# EAGLE design MainBoard (EAGLE 7.3.0)
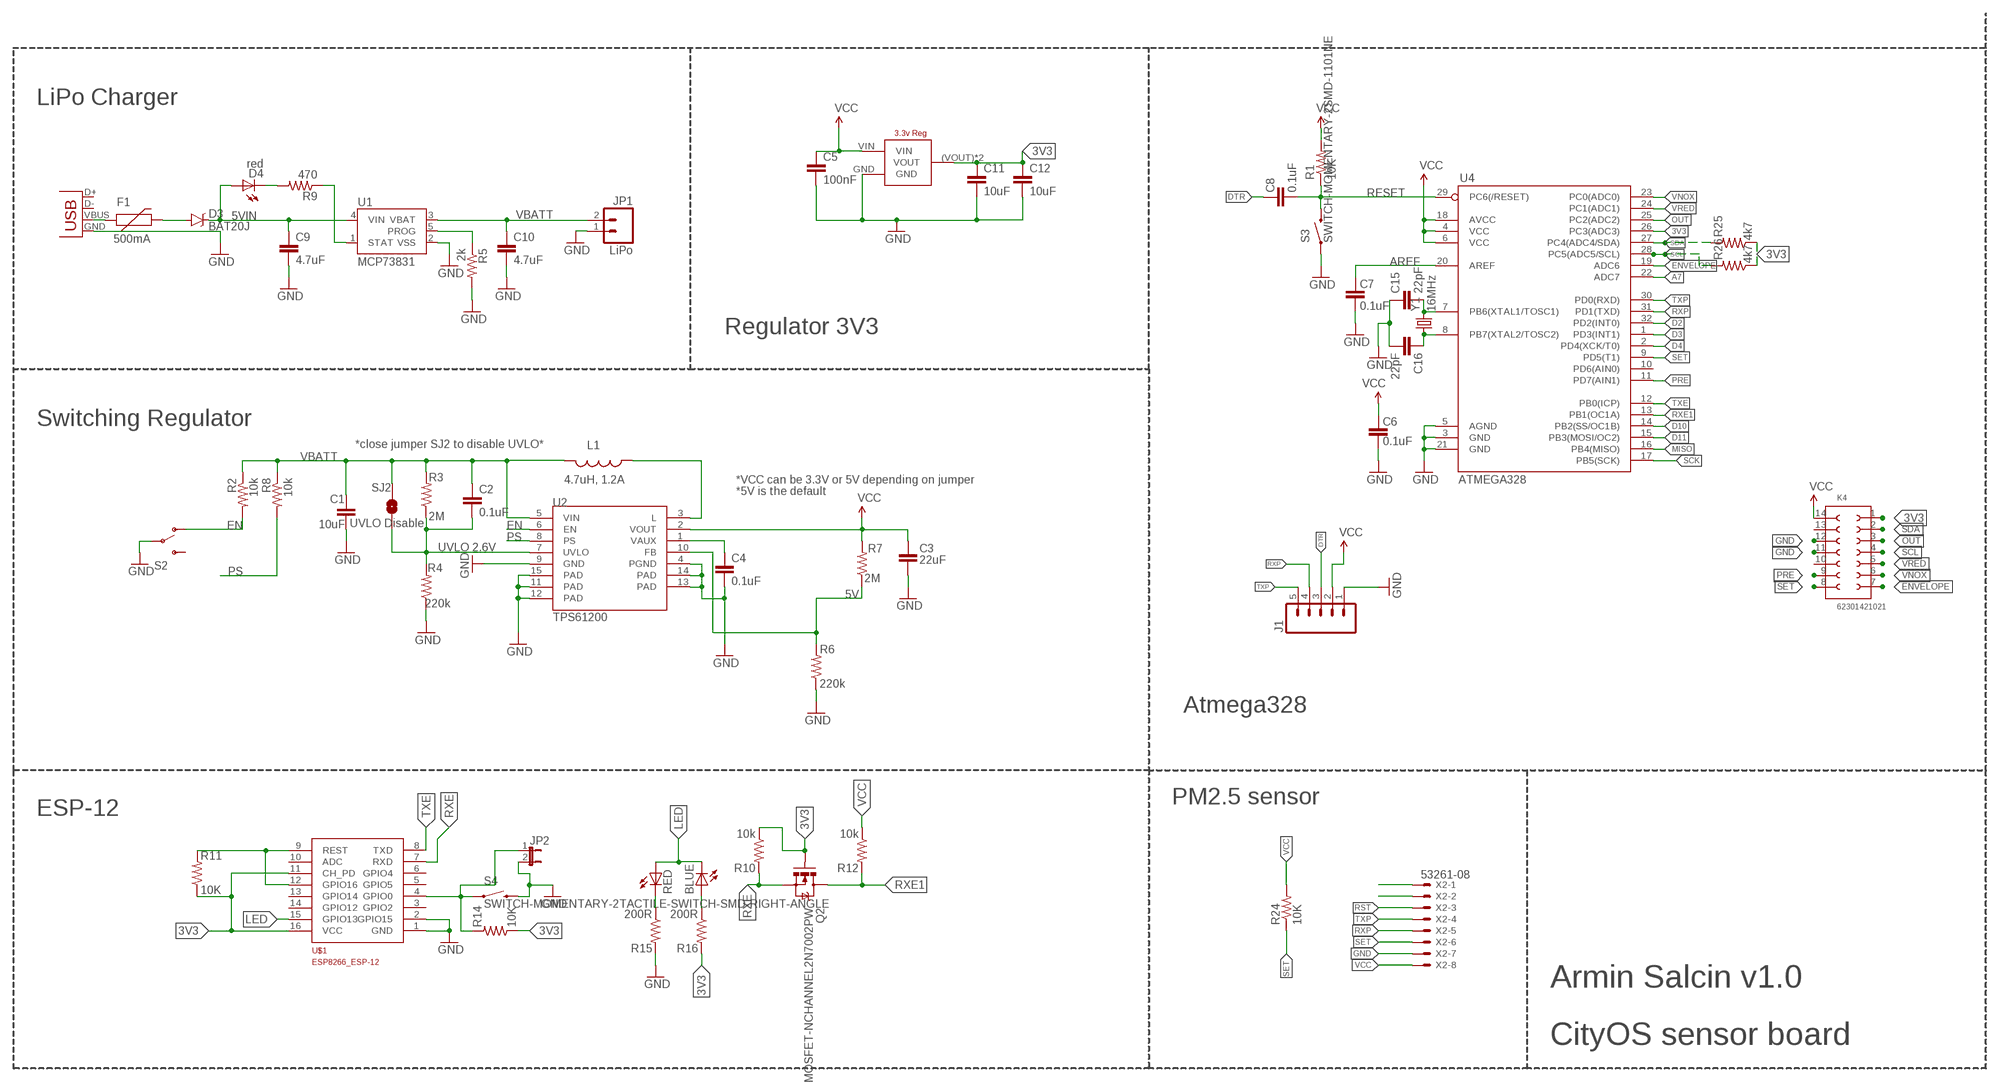
[diagram p0: schematic, sheet 1]

## Parts
BLUE  LEDCHIPLED_0805  [CHIPLED_0805]
C1  10uF  CAP1206  [1206]
C2  0.1uF  CAP0402-CAP  [0402-CAP]
C3  22uF  CAP0805  [0805]
C4  0.1uF  CAP0402-CAP  [0402-CAP]
C5  100nF  CAP0402-CAP  [0402-CAP]
C6  0.1uF  CAP0603-CAP  [0603-CAP]
C7  0.1uF  CAP0603-CAP  [0603-CAP]
C8  0.1uF  CAP0603-CAP  [0603-CAP]
C9  4.7uF  CAP0402-CAP  [0402-CAP]
C10  4.7uF  CAP0402-CAP  [0402-CAP]
C11  10uF  CAP0402-CAP  [0402-CAP]
C12  10uF  10UF-6.3V-20%(1206)  [1206]
C15  22pF  CAP0603-CAP  [0603-CAP]
C16  22pF  CAP0603-CAP  [0603-CAP]
D3  BAT20J  DIODE-SCHOTTKY-BAT20J  [SOD-323]
D4  red  LED0603  [LED-0603]
F1  500mA  PTC0603  [0603]
J1  M05PTH  [1X05]
JP1  LiPo  M02-JST-2MM-SMT  [JST-2-SMD]
JP2  JUMPER-2PTH  [1X02]
K4  62301421021  [62301421021]
L1  4.7uH, 1.2A  INDUCTOR.  [CDRH2D09]
Q2  MOSFET-NCHANNEL2N7002PW  [SOT323]
R1  10K  RESISTOR0603-RES  [0603-RES]
R2  10k  RESISTOR0402-RES  [0402-RES]
R3  2M  RESISTOR0402-RES  [0402-RES]
R4  220k  RESISTOR0402-RES  [0402-RES]
R5  2k  RESISTOR0402-RES  [0402-RES]
R6  220k  RESISTOR0402-RES  [0402-RES]
R7  2M  RESISTOR0402-RES  [0402-RES]
R8  10k  RESISTOR0402-RES  [0402-RES]
R9  470  RESISTOR0402-RES  [0402-RES]
R10  10k  RESISTOR0402-RES  [0402-RES]
R11  10K  RESISTOR0402-RES  [0402-RES]
R12  10k  RESISTOR0402-RES  [0402-RES]
R14  10K  RESISTOR0402-RES  [0402-RES]
R15  200R  RESISTOR0402-RES  [0402-RES]
R16  200R  RESISTOR0402-RES  [0402-RES]
R24  10K  10KOHM1/10W1%(0603)0603  [0603-RES]
R25  4k7  RESISTOR0402-RES  [0402-RES]
R26  4k7  RESISTOR0402-RES  [0402-RES]
RED  LEDCHIPLED_0805  [CHIPLED_0805]
S2  SWITCH-SPDT-SMD-A  [SWITCH-SPST-SMD-A]
S3  SWITCH-MOMENTARY-2SMD-1101NE  [TACTILE-SWITCH-1101NE]
S4  SWITCH-MOMENTARY-2TACTILE-SWITCH-SMD-RIGHT-ANGLE  [TACTILE_SWITCH-SMD-RIGHT-ANGLE]
SJ2  UVLO Disable  SOLDERJUMPERNO  [SJ_2S-NO]
U1  MCP73831  [SOT23-5]
U2  TPS61200  [QFN-10_PAD]
U4  ATMEGA328  ATMEGA168  [TQFP32-08]
U$1  ESP8266_ESP-12  [ESP8266-ESP12]
U$2  LD1117  [LD1117SOT-223]
X1  USB-MICROB  [USB-MICROB]
X2  53261-08  [53261-08]
Y1  16MHz  CRYSTALCRYSTAL-SMD-5X3-16MHZ  [CRYSTAL-SMD-5X3]

## Nets
3V3: C11.1 C12.1 K4.1 Q2.1(G) R10.1 R11.1 R14.1 R16.2 R25.1 R26.1 U4.26(PC3(ADC3)) U$1.11(CH_PD) U$1.16(VCC) U$2.(VOUT)(VOUT) U$2.VOUT
5V: R6.2 R7.1 U2.10(FB)
5VIN: C9.1 D3.C D4.A U1.4(VIN)
A7: U4.22(ADC7)
AREF: C7.2 U4.20(AREF)
D2: U4.32(PD2(INT0))
D3: U4.1(PD3(INT1))
D4: U4.2(PD4(XCK/T0))
D10: U4.14(PB2(SS/OC1B))
D11: U4.15(PB3(MOSI/OC2))
DTR: C8.2 J1.3
EN: R2.2 S2.1(O) U2.6(EN)
ENVELOPE: K4.7 U4.19(ADC6)
GND: C1.2 C3.2 C4.2 C5.2 C6.1 C7.1 C9.2 C10.2 C11.2 C12.2 C15.1 C16.2 J1.1 JP1.1 JP2.2 K4.11 K4.12 R4.1 R5.2 R6.1 R15.2 S2.2(P) S3.1 S4.2 U1.2(VSS) U2.4(PGND) U2.9(GND) U2.11(PAD) U2.12(PAD) U2.13(PAD) U2.14(PAD) U2.15(PAD) U4.3(GND) U4.5(AGND) U4.21(GND) U$1.1(GND) U$1.2(GPIO15) U$2.GND X1.GND X2.7
LED: BLUE.C RED.A U$1.15(GPIO13)
MISO: U4.16(PB4(MISO))
N$1: C4.1 U2.1(VAUX)
N$2: L1.P$1 U2.3(L)
N$3: C16.1 U4.8(PB7(XTAL2/TOSC2)) Y1.1
N$4: C15.2 U4.7(PB6(XTAL1/TOSC1)) Y1.3
N$5: JP2.1 R14.2 S4.1 U$1.4(GPIO0)
N$6: R11.2 U$1.9(REST) U$1.12(GPIO16)
N$7: F1.1 X1.VBUS
N$8: D4.C R9.2
N$9: R15.1 RED.C
N$10: BLUE.A R16.1
N$11: R5.1 U1.5(PROG)
N$12: X2.1
N$13: D3.A F1.2
N$14: R9.1 U1.1(STAT)
N$18: X2.2
OUT: K4.3 U4.25(PC2(ADC2))
PRE: K4.9 U4.11(PD7(AIN1))
PS: R8.2 U2.8(PS)
RESET: C8.1 R1.1 S3.2 U4.29(PC6(/RESET))
RST: X2.3
RXE: Q2.2(S) R10.2 U$1.7(RXD)
RXE1: Q2.3(D) R12.2 U4.13(PB1(OC1A))
RXP: J1.4 U4.31(PD1(TXD)) X2.5
SCK: U4.17(PB5(SCK))
SCL: K4.4 R26.2 U4.28(PC5(ADC5/SCL))
SDA: K4.2 R25.2 U4.27(PC4(ADC4/SDA))
SET: K4.8 R24.1 U4.9(PD5(T1)) X2.6
TXE: U4.12(PB0(ICP)) U$1.8(TXD)
TXP: J1.5 U4.30(PD0(RXD)) X2.4
UVLO: C2.2 R3.1 R4.2 SJ2.1 U2.7(UVLO)
VBATT: C1.1 C2.1 C10.1 JP1.2 L1.P$2 R2.1 R3.2 R8.1 SJ2.2 U1.3(VBAT) U2.5(VIN)
VCC: C3.1 C5.1 C6.2 J1.2 K4.14 R1.2 R7.2 R12.1 R24.2 U2.2(VOUT) U4.4(VCC) U4.6(VCC) U4.18(AVCC) U$2.VIN X2.8
VNOX: K4.6 U4.23(PC0(ADC0))
VRED: K4.5 U4.24(PC1(ADC1))
Unconnected: K4.10 K4.13 S2.3(S) U4.10(PD6(AIN0)) U$1.3(GPIO2) U$1.5(GPIO5) U$1.6(GPIO4) U$1.10(ADC) U$1.13(GPIO14) U$1.14(GPIO12) X1.D+ X1.D-

## Notes on the sheet
- LiPo Charger
- Regulator 3V3
- Switching Regulator
- *close jumper SJ2 to disable UVLO*
- *VCC can be 3.3V or 5V depending on jumper
- *5V is the default
- UVLO 2.6V
- Atmega328
- PM2.5 sensor
- ESP-12
- Armin Salcin v1.0
- CityOS sensor board

## Library data of the parts
BLUE RED = adafruit:LED: LED OSRAM: - CHIPLED LG R971, LG N971, LY N971, LG Q971, LY Q971, LO R971, LY R971 LH N974, LH R974 LS Q976, LO Q976, LY Q976 LO Q996 - Hyper CHIPLED LW Q18S LB Q993, LB Q99A, LB R99A - SideLED LS A670, LO A670, LY A670, LG A670, LP A670 LB A673, LV A673, LT A673, LW A673 LH A674 LY A675 LS A676, LA A676, LO A676, LY A676, LW A676 LS A679, LY A679, LG A679 - Hyper Micro SIDELED® LS Y876, LA Y876, LO Y876, LY Y876 LT Y87S - SmartLED LW L88C, LW L88S LB L89C, LB L89S, LG L890 LS L89K, LO L89K, LY L89K LS L896, LA L896, LO L896, LY L896 - TOPLED LS T670, LO T670, LY T670, LG T670, LP T670 LSG T670, LSP T670, LSY T670, LOP T670, LYG T670 LG T671, LOG T671, LSG T671 LB T673, LV T673, LT T673, LW T673 LH T674 LS T676, LA T676, LO T676, LY T676, LB T676, LH T676, LSB T676, LW T676 LB T67C, LV T67C, LT T67C, LS T67K, LO T67K, LY T67K, LW E67C LS E67B, LA E67B, LO E67B, LY E67B, LB E67C, LV E67C, LT E67C LW T67C LS T679, LY T679, LG T679 LS T770, LO T770, LY T770, LG T770, LP T770 LB T773, LV T773, LT T773, LW T773 LH T774 LS E675, LA E675, LY E675, LS T675 LS T776, LA T776, LO T776, LY T776, LB T776 LHGB T686 LT T68C, LB T68C - Hyper Mini TOPLED® LB M676 - Mini TOPLED Santana® LG M470 LS M47K, LO M47K, LY M47K Source: http://www.osram.convergy.de/
C1 C3 = CH_passive:CAP: Capacitor Standard 0603 ceramic capacitor, and 0.1" leaded capacitor.
C2 C4-C11 = SparkFun:CAP: Capacitor Standard 0603 ceramic capacitor, and 0.1" leaded capacitor.
C12 = SparkFun-Capacitors:10UF-6.3V-20%(1206): Ceramic CAP-10057; PROD_ID: CAP-10057
C15 C16 = SparkFun-Passives:CAP: Capacitor Standard 0603 ceramic capacitor, and 0.1" leaded capacitor.
D3 = SparkFun-DiscreteSemi:DIODE-SCHOTTKY: Schottky diodes in SFE's production catalog BAT20J 1A 23V 0.62Vf RB751 120mA 40V 0.37Vf PMEG4005EJ 0.5A 40V 0.42Vf MBRA140 1A 40V 0.5Vf B340A 3A 40V SMA; PROD_ID: DIO-11623
D4 = SparkFun:LED: LEDs Standard schematic elements and footprints for 5mm, 3mm, 1206, and 0603 sized LEDs. 5mm - Spark Fun Electronics SKU : COM-00529 (and others)
F1 = SparkFun-PowerIC:PTC: Resettable Fuse PTC Resettable Fuse. Spark Fun Electronics SKU : COM-08357
J1 = SparkFun-Connectors:M05: Header 5 Standard 5-pin 0.1" header. Use with straight break away headers (SKU : PRT-00116), right angle break away headers (PRT-00553), swiss pins (PRT-00743), machine pins (PRT-00117), and female headers (PRT-00115). Molex polarized connector foot print use with SKU : PRT-08230 with associated crimp pins and housings.
JP1 = SparkFun:M02: Header 2 Standard 2-pin 0.1" header. Use with straight break away headers (SKU : PRT-00116), right angle break away headers (PRT-00553), swiss pins (PRT-00743), machine pins (PRT-00117), and female headers (PRT-00115). Molex polarized connector foot print use with SKU : PRT-08233 with associated crimp pins and housings.
JP2 = SparkFun:JUMPER-2: Jumper Basic 0.1" spaced jumper. Use with breakaway headers.
K4 = Eagle_BOARD-TO-BOARD_CONNECTORS_rev15d:62301421021: WR-PHD 1.27mm Dual SMT Socket Header H=4.50mm, 14 Pins=>Code : Con_BTB_SHD_1.27_2_62301421021 <http://katalog.we-online.de/media/thumbs2/eican/thb_Con_BTB_SHD_1.27_2_6230xx21021_pf2.jpg> Details see: http://katalog.we-online.de/en/em/623_0xx_210_21 Created 2014-06-04, Karrer Zheng 2014 (C) Würth Elektronik
L1 = SparkFun:INDUCTOR: Inductors Basic Inductor/Choke - 0603 and 1206. Footprints are not proven and vary greatly between part numbers.
Q2 = SparkFun-DiscreteSemi:MOSFET-NCHANNEL: Common NMOSFET Parts MFG P/N Store ID Prod ID FDD8780 TRANS-09984 SI7820DN TRANS-11055 FDS6630A IC-08089 2N7002PW TRANS-11151 FQP30N06L COM-10213 TRANS-10060 BSS123LT1G TRANS-08345 BSS138 TRANS-00830 BS170 2N7000; PROD_ID: TRANS-11151
R1-R12 R14-R16 R25 R26 = SparkFun:RESISTOR: Resistor Basic schematic elements and footprints for 0603, 1206, and PTH resistors.
R24 = SparkFun-Resistors:10KOHM1/10W1%(0603): RES-00824; PROD_ID: RES-00824
S2 = SparkFun-Electromechanical:SWITCH-SPDT: SPDT Switch Simple slide switch, Spark Fun Electronics SKU : COM-00102 DPDT SMT slide switch, AYZ0202, SWCH-08179; PROD_ID: SWCH-10651
S3 = SparkFun-Electromechanical:SWITCH-MOMENTARY-2: Various NO switches- pushbuttons, reed, etc; PROD_ID: SWCH-00815
S4 = SparkFun-Electromechanical:SWITCH-MOMENTARY-2: Various NO switches- pushbuttons, reed, etc; PROD_ID: COMP-12265
SJ2 = SparkFun-Passives:SOLDERJUMPER: Solder Jumper Standard SMD solder jumper. Used to automate production. Two varients : Normally Open and Normally Closed are the same, but have different paste layers. NC will have a large amount of paste and should jumper during reflow.
U1 = SparkFun:MCP73831: Microchip's MCP73831 Miniature single cell, fully integrated Li-Ion, Li-polymer charge management controller http://ww1.microchip.com/downloads/en/DeviceDoc/21984a.pdf
U2 = SparkFun:TPS61200: DC to DC Booster
U4 = SparkFun:ATMEGA168
U$1 = ESP8266-ESP12:ESP8266_ESP-12
U$2 = LD1117:LD1117
X1 = SparkFun:USB: USB Connectors USB-B-PTH is fully proven SKU : PRT-00139 USB-miniB is fully proven SKU : PRT-00587 USB-A-PCB is untested. USB-A-H is throughly reviewed, but untested. Spark Fun Electronics SKU : PRT-00437 USB-B-SMT is throughly reviewed, but untested. Needs silkscreen touching up. USB-A-S has not been used/tested USB-MB-H has not been used/tested
X2 = con-molex:53?-08: CONNECTOR wire to board 1.25 mm (.049 inch) pitch header; OC_FARNELL: 1125376; OC_NEWARK: unknown
Y1 = SparkFun-FreqCtrl:CRYSTAL: Various standard crystals. Proven footprints.; PROD_ID: XTAL-08218

## Net classes
1 vcc: width 0.254 mm

## Board
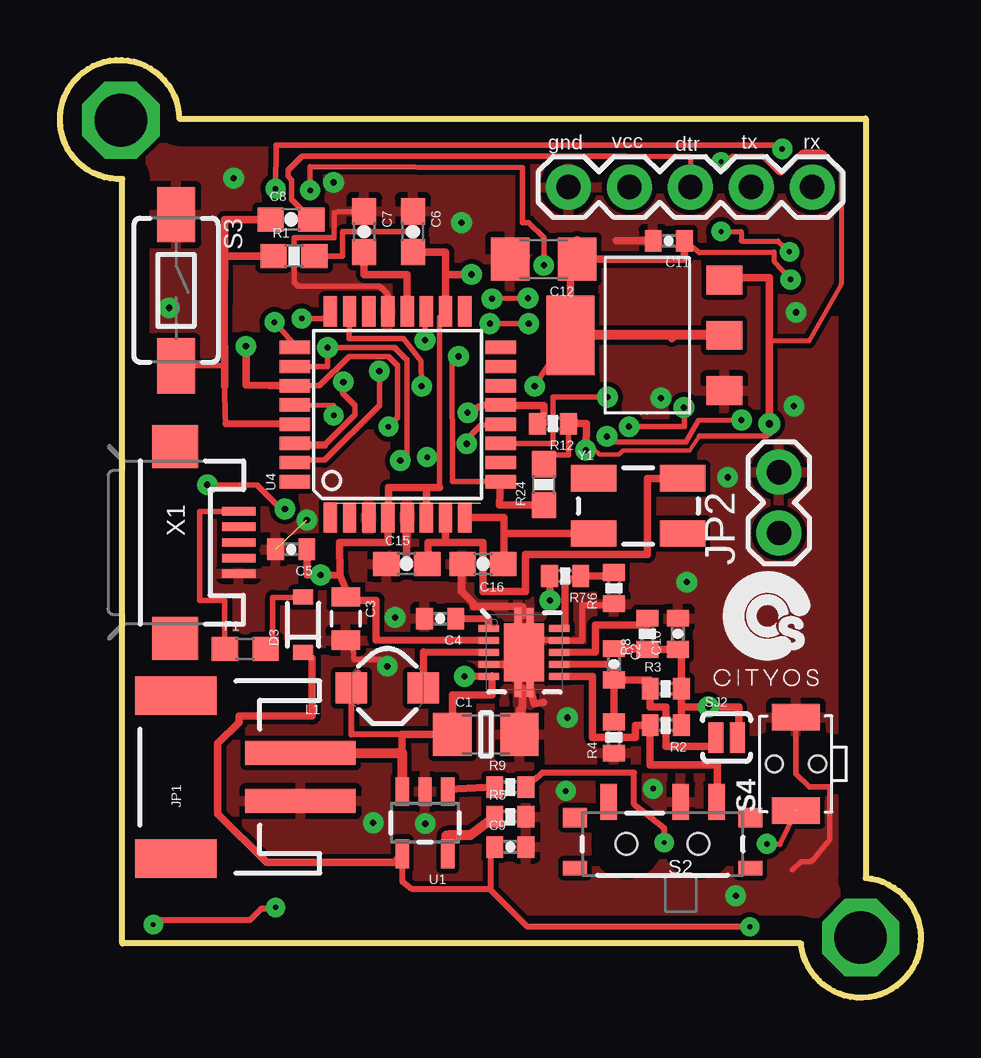
[diagram p1: board, top side]
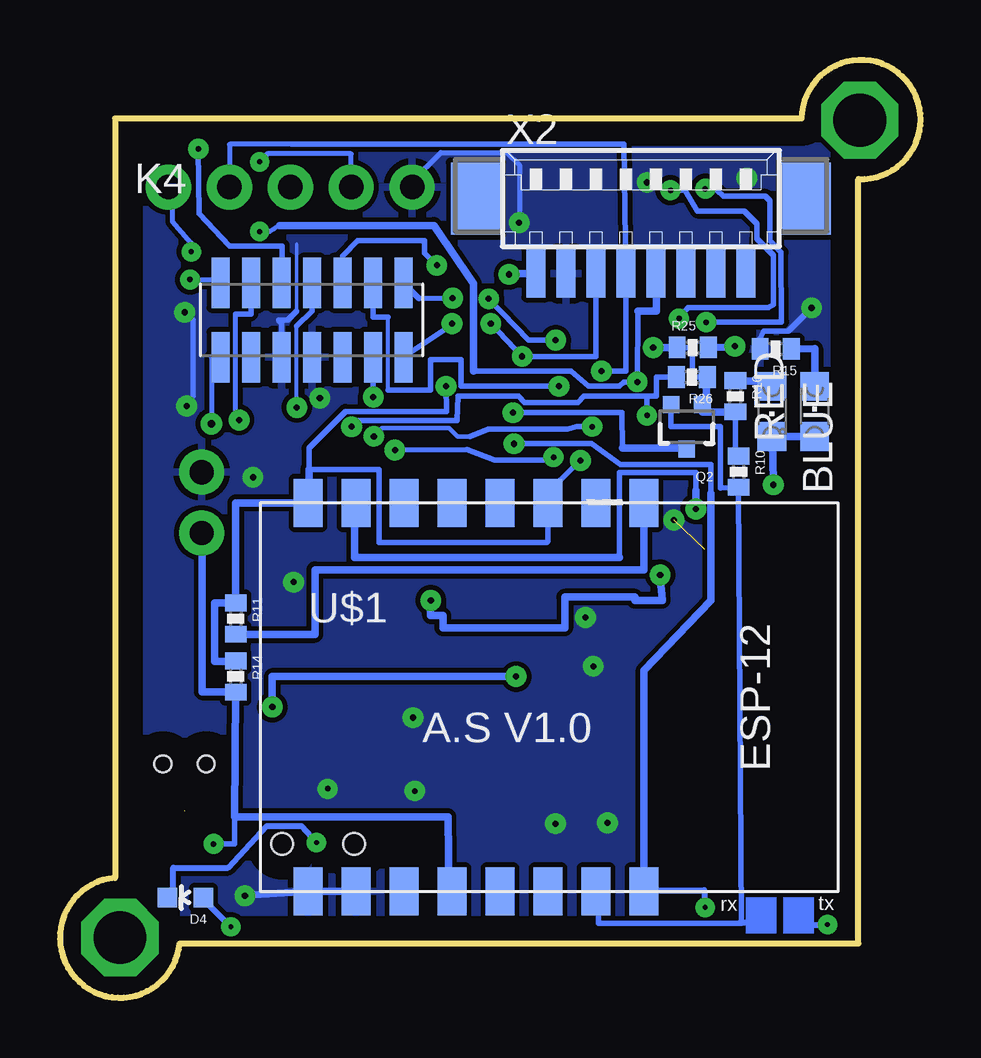
[diagram p2: board, bottom side, seen from below]

Size 35.88 x 39.09 mm. Coordinates in mm from the lower left corner, seen from the top.
Outline: 4.97,36.64 33.59,36.64 33.59,4.99 arc-260 30.89,2.26 2.6,2.26 2.6,34.12 arc-272 4.97,36.64
Copper layers (1*16): Top 0.035mm / dielectric 1.5mm / Bottom 0.035mm
Design rules "default *": minimum track width 10mil, minimum drill 12mil, track to track 8mil, track to pad 8mil, pad to pad 8mil, via to via 8mil, smd to smd 8mil, copper to edge 40mil, drill to drill 8mil, minimum pad ring 10mil, minimum via ring 12mil, stop-mask expansion 4mil, vias tented up to drill 0mil, thermal gap 10mil

### Footprints (pad centres in the part's own frame; a part is rotated, then mirrored left to right if it is on the bottom)
CHIPLED_0805 = smd 1.2 x 1.2: A 0,-1.05; C 0,1.05
1206 = smd 1.6 x 1.8: 1 -1.4,0; 2 1.4,0
0402-CAP = smd 0.7 x 0.9: 1 -0.65,0; 2 0.65,0
0805 = smd 0.8 x 1.2: 1 -0.9,0; 2 0.9,0
0603-CAP = smd 1.1 x 1: 1 -0.85,0; 2 0.85,0
SOD-323 = smd 0.63 x 0.83: A 1.15,0; C -1.15,0
LED-0603 = smd 0.8 x 0.8: A 0,-0.75; C 0,0.75
0603 = smd 1.1 x 1: 1 -0.85,0; 2 0.85,0
1X05 = drill 1.016 pad 1.88: 1 0,0; 2 2.54,0; 3 5.08,0; 4 7.62,0; 5 10.16,0
JST-2-SMD = smd 1 x 4.6: 1 -1,-3.7; 2 1,-3.7 | smd 1.6 x 3.4: NC1 -3.4,1.5; NC2 3.4,1.5
1X02 = drill 1.016 pad 1.88: 1 0,0; 2 2.54,0
62301421021 = smd 0.75 x 2.1: 1 -4.445,1.55; 2 -3.175,1.55; 3 -1.905,1.55; 4 -0.635,1.55; 5 0.635,1.55; 6 1.905,1.55; 7 3.175,1.55; 8 3.175,-1.55; 9 1.905,-1.55; 10 0.635,-1.55; 11 -0.635,-1.55; 12 -1.905,-1.55; 13 -3.175,-1.55; 14 -4.445,-1.55
CDRH2D09 = smd 1.3 x 1.3: P$1 -1.5,0; P$2 1.5,0
SOT323 = smd 0.7 x 0.7: 1 -0.65,-0.925; 2 0.65,-0.925; 3 0,0.925
0603-RES = smd 1.1 x 1: 1 -0.85,0; 2 0.85,0
0402-RES = smd 0.7 x 0.9: 1 -0.65,0; 2 0.65,0
SWITCH-SPST-SMD-A = smd 0.7 x 1.5: 1 -2.25,-1.75; 2 -0.75,-1.75; 3 2.25,-1.75 | smd 1 x 0.6: GND1 -3.65,1; GND3 3.65,1 | smd 1 x 0.8: GND2 -3.65,-1.1; GND4 3.65,-1.1 | hole 0.9: -1.5,0; 1.5,0
TACTILE-SWITCH-1101NE = smd 2.3 x 1.6: 1 -3.15,0; 2 3.15,0
TACTILE_SWITCH-SMD-RIGHT-ANGLE = smd 1.1 x 2: 1 -1.95,0; 2 1.95,0 | hole 0.7: 0,0.9; 0,-0.9
SJ_2S-NO = smd 0.635 x 1.27: 1 -0.45,0; 2 0.45,0
SOT23-5 = smd 0.55 x 1.2: 1 -0.95,-1.3; 2 0,-1.3; 3 0.95,-1.3; 4 0.95,1.3; 5 -0.95,1.3
QFN-10_PAD = smd 0.297 x 0.85: 1 -1,-1.475; 2 -0.5,-1.475; 3 0,-1.475; 4 0.5,-1.475; 5 1,-1.475; 6 1,1.475; 7 0.5,1.475; 8 0,1.475; 9 -0.5,1.475; 10 -1,1.475 | smd 0.7 x 0.28: 11 -1.5,0.25; 12 -1.5,-0.25; 13 1.5,0.25; 14 1.5,-0.25 | smd 2.4 x 1.65: 15 0,0
TQFP32-08 = smd 1.27 x 0.559: 1 -4.293,2.8; 2 -4.293,2; 3 -4.293,1.2; 4 -4.293,0.4; 5 -4.293,-0.4; 6 -4.293,-1.2; 7 -4.293,-2; 8 -4.293,-2.8; 17 4.293,-2.8; 18 4.293,-2; 19 4.293,-1.2; 20 4.293,-0.4; 21 4.293,0.4; 22 4.293,1.2; 23 4.293,2; 24 4.293,2.8 | smd 0.559 x 1.27: 9 -2.8,-4.293; 10 -2,-4.293; 11 -1.2,-4.293; 12 -0.4,-4.293; 13 0.4,-4.293; 14 1.2,-4.293; 15 2,-4.293; 16 2.8,-4.293; 25 2.8,4.293; 26 2,4.293; 27 1.2,4.293; 28 0.4,4.293; 29 -0.4,4.293; 30 -1.2,4.293; 31 -2,4.293; 32 -2.8,4.293
ESP8266-ESP12 = smd 2 x 1.2: 1 16.2,2; 2 16.2,4; 3 16.2,6; 4 16.2,8; 5 16.2,10; 6 16.2,12; 7 16.2,14; 8 16.2,16; 9 0,16; 10 0,14; 11 0,12; 12 0,10; 13 0,8; 14 0,6; 15 0,4; 16 0,2
LD1117SOT-223 = smd 3.3 x 2: (VOUT) 0,3.2 | smd 1.2 x 1.5: GND -2.3,-3.2; VIN 2.3,-3.2; VOUT 0,-3.2
USB-MICROB = smd 0.35 x 1.4: D+ 0,2.65; D- -0.65,2.65; GND 1.3,2.65; ID 0.65,2.65; VBUS -1.3,2.65 | smd 1.8 x 1.9: MT1 -4,0; MT2 4,0
53261-08 = smd 0.8 x 2: 1 4.375,-2.5; 2 3.125,-2.5; 3 1.875,-2.5; 4 0.625,-2.5; 5 -0.625,-2.5; 6 -1.875,-2.5; 7 -3.125,-2.5; 8 -4.375,-2.5 | smd 2.1 x 3: S1 6.875,0.625; S2 -6.875,0.625
CRYSTAL-SMD-5X3 = smd 1.9 x 1.1: 1 -1.85,-1.15; 2 1.85,-1.15; 3 1.85,1.15; 4 -1.85,1.15

### Placement (x,y rotation side)
BLUE  6.2,24.44 180 bottom
C1  17.76,10.97 0 top
C2  23.09,13.89 270 top
C3  11.92,15.8 270 top
C4  15.85,15.8 180 top
C5  9.64,18.69 180 top
C6  14.71,31.93 270 top
C7  12.68,31.93 270 top
C8  9.63,32.44 0 top
C9  18.77,6.28 0 top
C10  25.76,15.16 90 top
C11  25.38,31.55 180 top
C12  20.17,30.79 180 top
C15  14.46,18.09 0 top
C16  17.63,18.09 180 top
D3  10.14,15.55 90 top
D4  30.65,4.17 90 bottom
F1  7.72,14.53 0 top
J1  21.2,33.79 0 top
JP1  6.33,9.2 90 top
JP2  29.98,19.37 90 top
K4  24.74,28.25 0 bottom
L1  13.65,12.91 180 top
Q2  9.76,23.8 180 bottom
R1  9.76,30.91 0 top
R2  25.25,11.35 180 top
R3  25.25,12.88 0 top
R4  23.09,10.85 90 top
R5  18.77,7.54 0 top
R6  23.09,17.07 90 top
R7  21.06,17.58 180 top
R8  24.49,15.16 90 top
R9  18.77,8.78 0 top
R10  7.59,21.93 270 bottom
R11  28.55,15.8 270 bottom
R12  20.55,23.93 180 top
R14  28.55,13.39 270 bottom
R15  6.05,27.04 180 bottom
R16  7.72,25.07 270 bottom
R24  20.17,21.39 90 top
R25  9.5,27.1 0 bottom
R26  9.54,25.87 180 bottom
RED  4.42,24.44 0 bottom
S2  25.12,6.4 180 top
S3  4.84,29.49 270 top
S4  30.69,9.74 90 top
SJ2  27.79,10.85 0 top
U1  15.22,7.29 180 top
U2  19.35,14.39 270 top
U4  14.07,24.31 90 top
U$1  27.54,20.63 270 bottom
U$2  24.49,27.61 90 top
X1  4.8,18.97 270 top
X2  11.66,32.69 0 bottom
Y1  24.11,20.5 0 top

### Tracks (layer width: path | path; a pad name or v marks a point on that pad's centre or on a via)
3V3  (via drill 0.23 pad 0.13, 0.25)
  Top 0.2: 29.77,31.07 29.77,30.69 v30.46,29.93
  Top 0.229: U4.26 11.15,26.31 v11.15,27.1 13.95,27.1 14.46,26.59 14.48,26.59 14.48,22.68 v14.19,22.39 | v19.79,25.49 20.93,27.25 U$2.(VOUT) | 29.77,31.07 26.65,31.07 C11.1
  Top 0.305: C11.1 26.03,30.79 C12.1 21.29,30.79 U$2.(VOUT) | U$2.VOUT 25.63,27.61 25.51,27.48
  Top 0.406: 21.57,31.55 C12.1 | U$2.VOUT U$2.(VOUT)
  Bottom 0.22: R26.1 9.51,25.87 9.51,27.1 R25.1
  Bottom 0.229: R10.1 7.73,22.55 R16.2 | v19.79,25.49 19.78,24.44 23.98,24.44 25.51,22.91 25.51,22.02 22.58,22.02 22.58,18.97 15.6,18.97 15.54,19.04 15.54,21.05 15.54,21.32 15.28,21.32 v14.19,22.39 | K4.1 29.19,29.92 v30.46,29.93
  Bottom 0.305: 25.51,22.02 25.51,20.66 U$1.16 28.55,20.63 R11.1 29.44,16.45 29.44,14.02 28.55,14.02 R14.1 | R16.2 9.11,24.42 Q2.1 8.98,24.73 R26.1 | v11.15,27.1 R25.1 | U$1.11 15.54,21.05
5V
  Top 0.305: U2.10 21.06,15.4 21.06,17.45 21.71,17.45 R7.1 23.09,17.58 R6.2
5VIN  (via drill 0.2)
  Top 0.254: C9.1 17.96,6.24 17.96,4.54 17.9,4.54 | U1.4 14.27,4.85 14.66,4.54 17.9,4.54 | v28.76,2.95 19.49,2.95 17.9,4.54
  Top 0.305: C9.1 18,6.4 | D3.C 10.52,14.14 10.52,11.74 7.47,11.74 7.47,11.48 6.58,10.59 6.58,7.67 8.61,5.64 13.92,5.64 U1.4
  Bottom 0.254: D4.A 29.9,4.1 v28.76,2.95 28.73,2.95
AREF
  Top 0.305: 14.46,28.6 U4.20 14.48,30.15 12.68,30.15 C7.2
DTR
  Top 0.2: J1.3 26.28,35.08 23.6,35.08
  Top 0.229: 23.6,35.08 10.09,35.08 9.5,34.49 9.5,34.24 9.66,34.09 9.66,33.26 C8.2
  Top 0.305: C8.2 10.39,32.18
EN
  Top 0.305: S2.1 27.41,8.15 27.41,9.7 24.6,9.7 R2.2 23.98,11.35 23.98,10.85 22.2,10.85 22.2,13.39 U2.6
ENVELOPE  (via drill 0.25)
  Top 0.229: U4.19 15.22,28.6 v15.22,27.41 | v18.01,29.13 v19.51,29.16
  Bottom 0.229: v15.22,27.41 16.36,27.41 v18.01,29.13 | v19.51,29.16 20.91,29.13 K4.7
GND  (via drill 0.23 pad 0.25, 0.25 pad 0.25)  (1 unrouted)
  Top 0.229: C3.2 12.17,14.9 12.27,14.1 13.75,14.1 v13.65,13.81 | S4.2 30.69,9.32 31.23,8.78 32.1,8.78 32.1,6.59 31.37,5.7 31.3,5.7 31.26,5.67 30.88,5.67 30.53,5.32 | U4.21 13.68,29.31 13.31,29.67 9.92,29.67 9.76,29.83 9.76,31.67 11.43,31.67 11.43,32.73 11.62,32.77 12.67,32.77 C7.1
  Top 0.254: R6.1 23.09,16.37 21.78,16.37 21.78,14.89 U2.9 19.35,14.89 U2.15
  Top 0.305: C1.2 19.16,11.99 19.28,11.99 19.28,12.9 U2.14 19.29,13.89 | U2.13 19.79,12.24 20.15,12.3 | 19.29,13.89 19.29,14.4 | 19.29,14.4 U2.15 | U2.4 18.06,13.89 19.29,13.89 | 19.29,14.4 U2.12 19.28,15.9 19.28,16.31 17.25,16.31 17.25,16.43 16.74,16.94 16.74,18.05 C16.2 | U4.5 14.46,20.02 14.46,18.09 C15.1 | C11.2 23.2,31.56
  Bottom 0.15: 26.01,28.63 26.01,31.42
  Bottom 0.2: J1.1 21.2,34.03 20,35.23 17.24,35.23 16.73,34.72 v16.73,32.32 v16.74,32.31
  Bottom 0.229: 30.71,28.63 30.33,28.25 30.33,25.07 | K4.12 26.65,28.12 26.78,28.25 26.39,28.25 26.01,28.63 | v27.84,21.69 v27.83,21.7 | R15.2 6.7,27.48 6.54,27.79 5.52,27.79 v4.55,28.75
  Bottom 0.305: U$1.2 U$1.1 28.14,4.28
  other vias: 21.09,8.62 13.06,7.29 26.14,17.32 15.23,7.25 28.17,4.24 10.29,19.91 13.97,15.85 25.05,24.99 11.41,33.99 30.6,24.67 7.24,34.16 30.69,28.57 24.72,8.71 21.16,11.67
  pour Top: -29.46,85.62 -31.11,85.75 -31.11,-1.88 77.22,-2.01 77.22,85.62
  pour Bottom: -50.03,87.53 -50.03,-8.61 86.62,-8.61 86.62,89.18 -50.03,89.18
LED  (via drill 0.25)
  Top 0.229: v9.38,20.37 9.21,20.37 8.21,21.37 v6.15,21.37 v6.14,21.38
  Bottom 0.229: 12.55,18.34 12.55,21.9 9.38,21.9 9.38,21.13
  Bottom 0.305: RED.A BLUE.C 6.17,22.53 v6.14,21.38 | U$1.15 23.6,20.63 23.6,18.34 12.55,18.34 | 9.38,21.13 v9.38,20.37
N$1
  Top 0.305: C4.1 17.87,15.79 U2.1
N$2
  Top 0.305: L1.P$1 15.15,14.4 U2.3
N$3
  Top 0.305: C16.1 18.52,18.09 18.52,19.36 | 18.52,19.36 21.75,19.36 Y1.1 | U4.8 18.52,20.02 18.52,19.36
N$4
  Top 0.305: Y1.3 24.49,21.65 24.49,18.47 19.41,18.47 19.41,16.94 17.63,16.94 17.63,18.97 16.08,18.97 | 16.08,18.97 U4.7 | C15.2 15.35,18.09 15.35,18.97 16.08,18.97
N$5  (via drill 0.23 pad 0.13)  (1 unrouted)
  Top 0.229: S4.1 30.01,6.4 v29.48,6.41
  Top 0.305: 29.95,19.36 JP2.1
  Bottom 0.229: v29.48,6.41 28.6,6.41 28.6,7.54
  Bottom 0.305: JP2.1 29.95,19.36 29.95,12.75 28.55,12.75 R14.2 28.6,7.54 19.71,7.54 19.66,4.43 U$1.4
N$6  (1 unrouted)
  Bottom 0.305: R11.2 25.25,15.15 25.25,17.83 11.54,17.83 U$1.9
N$7
  Top 0.229: X1.VBUS 5.82,20.27 5.82,16.56 6.88,16.56 F1.1
N$8  (via drill 0.2)
  Top 0.254: v25.19,6.46 25.19,7.06 23.93,8.05 23.93,9.37 20.11,9.37 R9.2
  Bottom 0.254: D4.C 31.16,3.99 31.16,5.41 28.88,5.41 27.26,7.15 25.82,7.15 v25.19,6.46
N$9
  Bottom 0.305: R15.1 4.42,27.05 RED.C
N$10
  Bottom 0.305: BLUE.A 6.33,25.49 6.33,25.71 7.6,25.71 R16.1
N$11
  Top 0.406: U1.5 16.11,6.75 16.23,6.78 17.11,6.78 R5.1
N$13
  Top 0.229: F1.2 8.87,14.53 8.87,16.69 D3.A
N$14
  Top 0.305: U1.1 16.17,8.69 R9.1
N$15
  Bottom 0.254: 7.52,3.13 6.56,3.13 6.56,3.25
N$16  (via drill 2.2)
  other vias: 33.38,2.5
N$17  (via drill 2.2)
  other vias: 2.54,36.58
N$19
  Bottom 0.254: 11.57,4.48 9.02,4.48 9.02,3.76
N$20
  Top 0.254: 8.99,3.7 8.39,3.7 7.91,3.22 4.07,3.22 3.89,3.04
N$21  (via drill 0.2)
  other vias: 8.99,3.76
N$22  (via drill 0.2)
  other vias: 3.89,3.04
N$23
  Bottom 0.254: 3.92,3.01 4.76,3.01 5.18,3.43
OUT  (via drill 0.23 pad 0.13)
  Top 0.229: U4.25 9.88,27.11 v8.94,28.16 | v8.98,33.72 9.01,35.53 30.08,35.54 v30.11,35.38
  Bottom 0.229: K4.3 26.62,31.33 28.81,31.33 30.08,32.69 v30.11,35.38 | v8.94,28.16 8.03,28.17 5.81,28.17 5.82,31.05 5.82,31.08 6.29,31.55 6.29,33.22 6.47,33.4 8.23,33.4 8.51,33.68 8.56,33.72 v8.98,33.72
PRE  (via drill 0.25)
  Top 0.229: U4.11 20.55,23.11 20.55,25.03 v22.83,25.03
  Bottom 0.229: 22.97,24.82 v22.83,25.03 K4.9
PS
  Top 0.305: U2.8 22.33,14.4 22.33,15.55 24.49,15.55 R8.2
RESET
  Top 0.229: S3.2 6.84,26.34 6.86,25.48 6.89,24.16 6.93,23.93
  Top 0.305: C8.1 6.87,32.44 6.85,28.93 | 6.86,25.48 6.85,28.93 | 6.85,28.93 6.86,30.91 R1.1 | U4.29 6.93,23.93
RXE
  Bottom 0.229: U$1.7 13.44,4.43 13.44,3.1 7.47,3.1 R10.2 8.36,21.25 8.36,23.8 10.41,23.8 Q2.2
RXE1  (via drill 0.25)
  Top 0.305: R12.2 20.17,23.93 20.17,24.69 18.37,24.69 U4.13 17.61,24.71 v17,24.39
  Bottom 0.229: v17,24.39 12.45,24.4 12.42,22.91
  Bottom 0.305: 12.42,22.91 9.79,22.91 Q2.3
RXP  (via drill 0.25)
  Top 0.229: v13.31,26.12 13.33,24.68 11.03,22.4 9.88,22.4
  Top 0.305: 9.88,22.4 U4.31
  Bottom 0.2: J1.4 28.82,35.57 26.22,35.57
  Bottom 0.229: 26.22,35.57 12.36,35.57 X2.5 12.29,26.12 v13.31,26.12
SCL  (via drill 0.23, 0.25)
  Top 0.229: U4.28 11.41,24.68 v11.41,24.27 | v23.73,23.8 26.03,23.8 v26.01,24.6
  Bottom 0.17: v26.01,24.6 26.01,27.99
  Bottom 0.229: R26.2 11.03,25.87 11.03,25.07 11.41,25.07 | 11.41,25.07 v11.41,24.27 | 26.01,27.99 25.38,28.63 K4.4 | 11.41,25.07 14.04,25.07 14.29,24.82 16.51,24.82 16.77,25.07 19.28,25.07 19.32,24.07 23.46,24.07 v23.73,23.8
SDA  (via drill 0.23, 0.25)
  Top 0.229: U4.27 10.83,25.51 12.04,26.72 13.69,26.72 14.08,26.34 14.08,24.18 v13.69,23.8 | v28.41,24.08 26.61,24.07 26.09,23.17 22.91,23.17 v22.8,23.4
  Top 0.305: U4.27 8.74,25.51 7.76,25.53 v7.75,27.15
  Bottom 0.19: 18.79,23.39 19.31,23.39 19.67,23.74 22.45,23.74 v22.8,23.4
  Bottom 0.203: 28.55,24.05 28.55,28.5
  Bottom 0.229: v13.69,23.8 14.33,23.8 14.72,23.71 18.02,23.71 18.79,23.39 | v28.41,24.08 28.55,24.05 | 28.55,28.5 27.92,28.5 K4.2
  Bottom 0.305: 8.87,27.1 R25.2 7.89,27.12 v7.75,27.15
SET  (via drill 0.25)
  Top 0.229: U4.9 16.36,21.51 16.35,26.75 v16.62,26.73 | v17.92,28.1 v19.54,28.1
  Top 0.305: R24.1 18.32,20.54 U4.9
  Bottom 0.229: X2.6 13.54,26.73 v16.62,26.73 v17.92,28.1 | v19.54,28.1 19.66,27.97 K4.8
TXE  (via drill 0.25)
  Top 0.229: v16.96,23.09 16.96,23.27 17.55,23.86 18.32,23.86 U4.12
  Top 0.305: 18.26,23.8 U4.12
  Bottom 0.229: v16.96,23.09 13.73,23.1 12.51,22.22 8.74,22.22 8.74,21.01
  Bottom 0.305: U$1.8 11.54,13.64 8.74,16.56 8.74,21.01
TXP  (via drill 0.2, 0.25)
  Top 0.2: v27.56,31.93 28.4,31.93 28.4,31.54 29.93,31.54 v30.41,31.09
  Top 0.229: v11.81,25.67 11.79,25.2 12.3,24.69 12.3,24.31 11.03,23.04
  Top 0.305: 11.03,23.04 9.85,23.04 U4.30
  Bottom 0.2: 26.73,32.18 26.77,32.18 26.96,32.05 27.14,31.93 v27.56,31.93 | v30.41,31.09 30.41,31.45 31.19,32.35 31.19,33.62 J1.5
  Bottom 0.229: 11.79,28.63 v11.81,25.67 12.37,25.67 12.55,25.49 13.86,25.49 14.58,26.11 18.65,26.11
  Bottom 0.305: 26.73,32.18 20.3,32.18 18.65,29.77 18.65,26.11 | 11.79,28.63 11.03,28.63 11.03,29.39 11.04,29.39 X2.4
UVLO
  Top 0.305: C2.2 24.6,13.24 R3.1 24.6,12.12 25.25,12.12 25.25,10.47 27.41,10.47 27.41,10.85 SJ2.1 | C2.2 R4.2 | C2.2 23.09,13.9 U2.7
VBATT  (via drill 0.25 pad 0.25)
  Top 0.254: 14.27,10.97 12.15,10.97 L1.P$2
  Top 0.305: 14.27,10.2 14.27,10.97 C1.1 16.36,12.62 18.01,12.62 18.01,13.4 U2.5 16.87,13.4 v16.87,13.39 | 12.42,12.37 12.42,13.51 L1.P$2 | R2.1 25.9,12.12 | 25.9,12.12 R3.2 25.9,14.51 C10.1 R8.1 24.49,14.54 C2.1 | 25.9,12.12 v27.03,12.12 28.3,12.12 28.3,10.85 SJ2.2
  Top 0.406: JP1.2 14.27,10.2 U1.3
  Bottom 0.305: v16.87,13.39 27.03,13.39 v27.03,12.12
VCC  (via drill 0.2, 0.23 pad 0.25, 0.25, 0.25 pad 0.25, 0.3)
  Top 0.19: 26.65,23.42 26.27,22.82 26.22,22.8 26.17,22.81 23.48,22.81 23.3,22.63 22.49,22.63 22.29,22.83 v21.92,22.83
  Top 0.2: v27.56,34.84 27.8,34.84 28.04,35.08 29.3,35.08 29.99,34.39 30.11,34.39 30.98,35.26 31.76,35.26 32.57,34.45 32.57,29.74 31.22,27.37 29.57,27.37
  Top 0.229: 15.82,21.26 15.82,22.54 | 14.71,31.93 11.79,31.93 11.79,30.91 R1.2 | v15.31,22.53 15.82,22.54 | 15.82,22.54 15.82,28.35 U4.18 | 20.01,22.62 21.2,22.62 R12.1 | 26.65,23.42 29.44,23.42 29.57,23.55
  Top 0.305: 15.28,21.26 13.69,21.26 13.69,20.02 U4.4 13.68,18.97 11.66,18.97 11.67,17.61 | 15.28,21.26 U4.6 | 15.28,21.26 15.82,21.26 | 16.11,28.6 U4.18 16.08,30.15 | 16.08,30.15 16.08,31.08 C6.2 14.71,31.93 | U2.2 13.19,14.9 13.19,16.56 11.92,16.56 C3.1 12.04,16.7 11.67,17.61 | R7.2 20.43,17.58 v20.43,16.56 | 11.67,17.61 v10.86,17.62 10.29,17.61 C5.1 | v17.16,30.15 16.08,30.15 | 29.57,23.55 v29.57,23.92 29.57,27.37 29.57,30.02 27.69,30.02 U$2.VIN | 20.02,22.49 R24.2 20.01,22.62 | 21.44,24.05 R12.1 21.95,23.94 v21.92,22.83
  Bottom 0.2: K4.14 29.57,26.7 v29.57,23.92 | v27.56,34.84 27.23,35.17 23.75,35.17 23.74,35.16 J1.2
  Bottom 0.229: v21.92,22.83 18.91,22.85 17.76,22.4 15.35,22.4
  Bottom 0.305: v10.86,17.62 10.77,16.56 11.92,16.56 C3.1 14.84,16.7 14.84,15.42 19.92,15.42 19.92,15.93 20.43,15.93 v20.43,16.56 | X2.8 17.25,30.19 v17.16,30.15 | 15.35,22.4 v15.31,22.53
VNOX  (via drill 0.25)
  Top 0.229: U4.23 12.08,27.96 12.04,27.48 14.33,27.48 15.05,26.54 v15.08,25.49
  Bottom 0.17: 22.2,25.32 22.2,28.37
  Bottom 0.229: v15.08,25.49 19.16,25.5 19.16,26.59 20.43,26.59 20.43,25.32 22.2,25.32 | 22.2,28.37 22.84,28.37 K4.6
VRED  (via drill 0.23 pad 0.13, 0.25)
  Top 0.229: v20.17,30.53 20.17,31.67 19.54,32.31 19.28,32.31 19.28,34.6 10.43,34.65 v10.43,33.66 | v10.07,28.31 10.98,28.31 U4.24
  Bottom 0.229: K4.5 24.11,30.91 23.47,31.55 20.68,31.55 20.68,31.04 v20.17,30.53 | v10.43,33.66 9.83,33.66 9.31,32.79 7.36,32.79 6.84,32.27 6.84,31.64 6.15,30.95 6.15,28.88 6.34,28.77 9.71,28.77 v10.07,28.31
(copper drawn outside any net)
  shapes: Bottom area x2

### Text on the board
tPlace: gnd | vcc | dtr | tx | rx
bPlace: A.S V1.0 | tx | rx
200bmp: /Users/arminsalcin/Downloads/11223518_1386966448271502_7885507353916088651_o.bmp